# EasyEDA schematic SCH_Main_board_2023-06-05.json
TITLE: Sheet_1; REV: 1.0; Date: 2023-03-05; Sheet: 1/1; Drawn By: 张良桢; Company: 华北理工大学
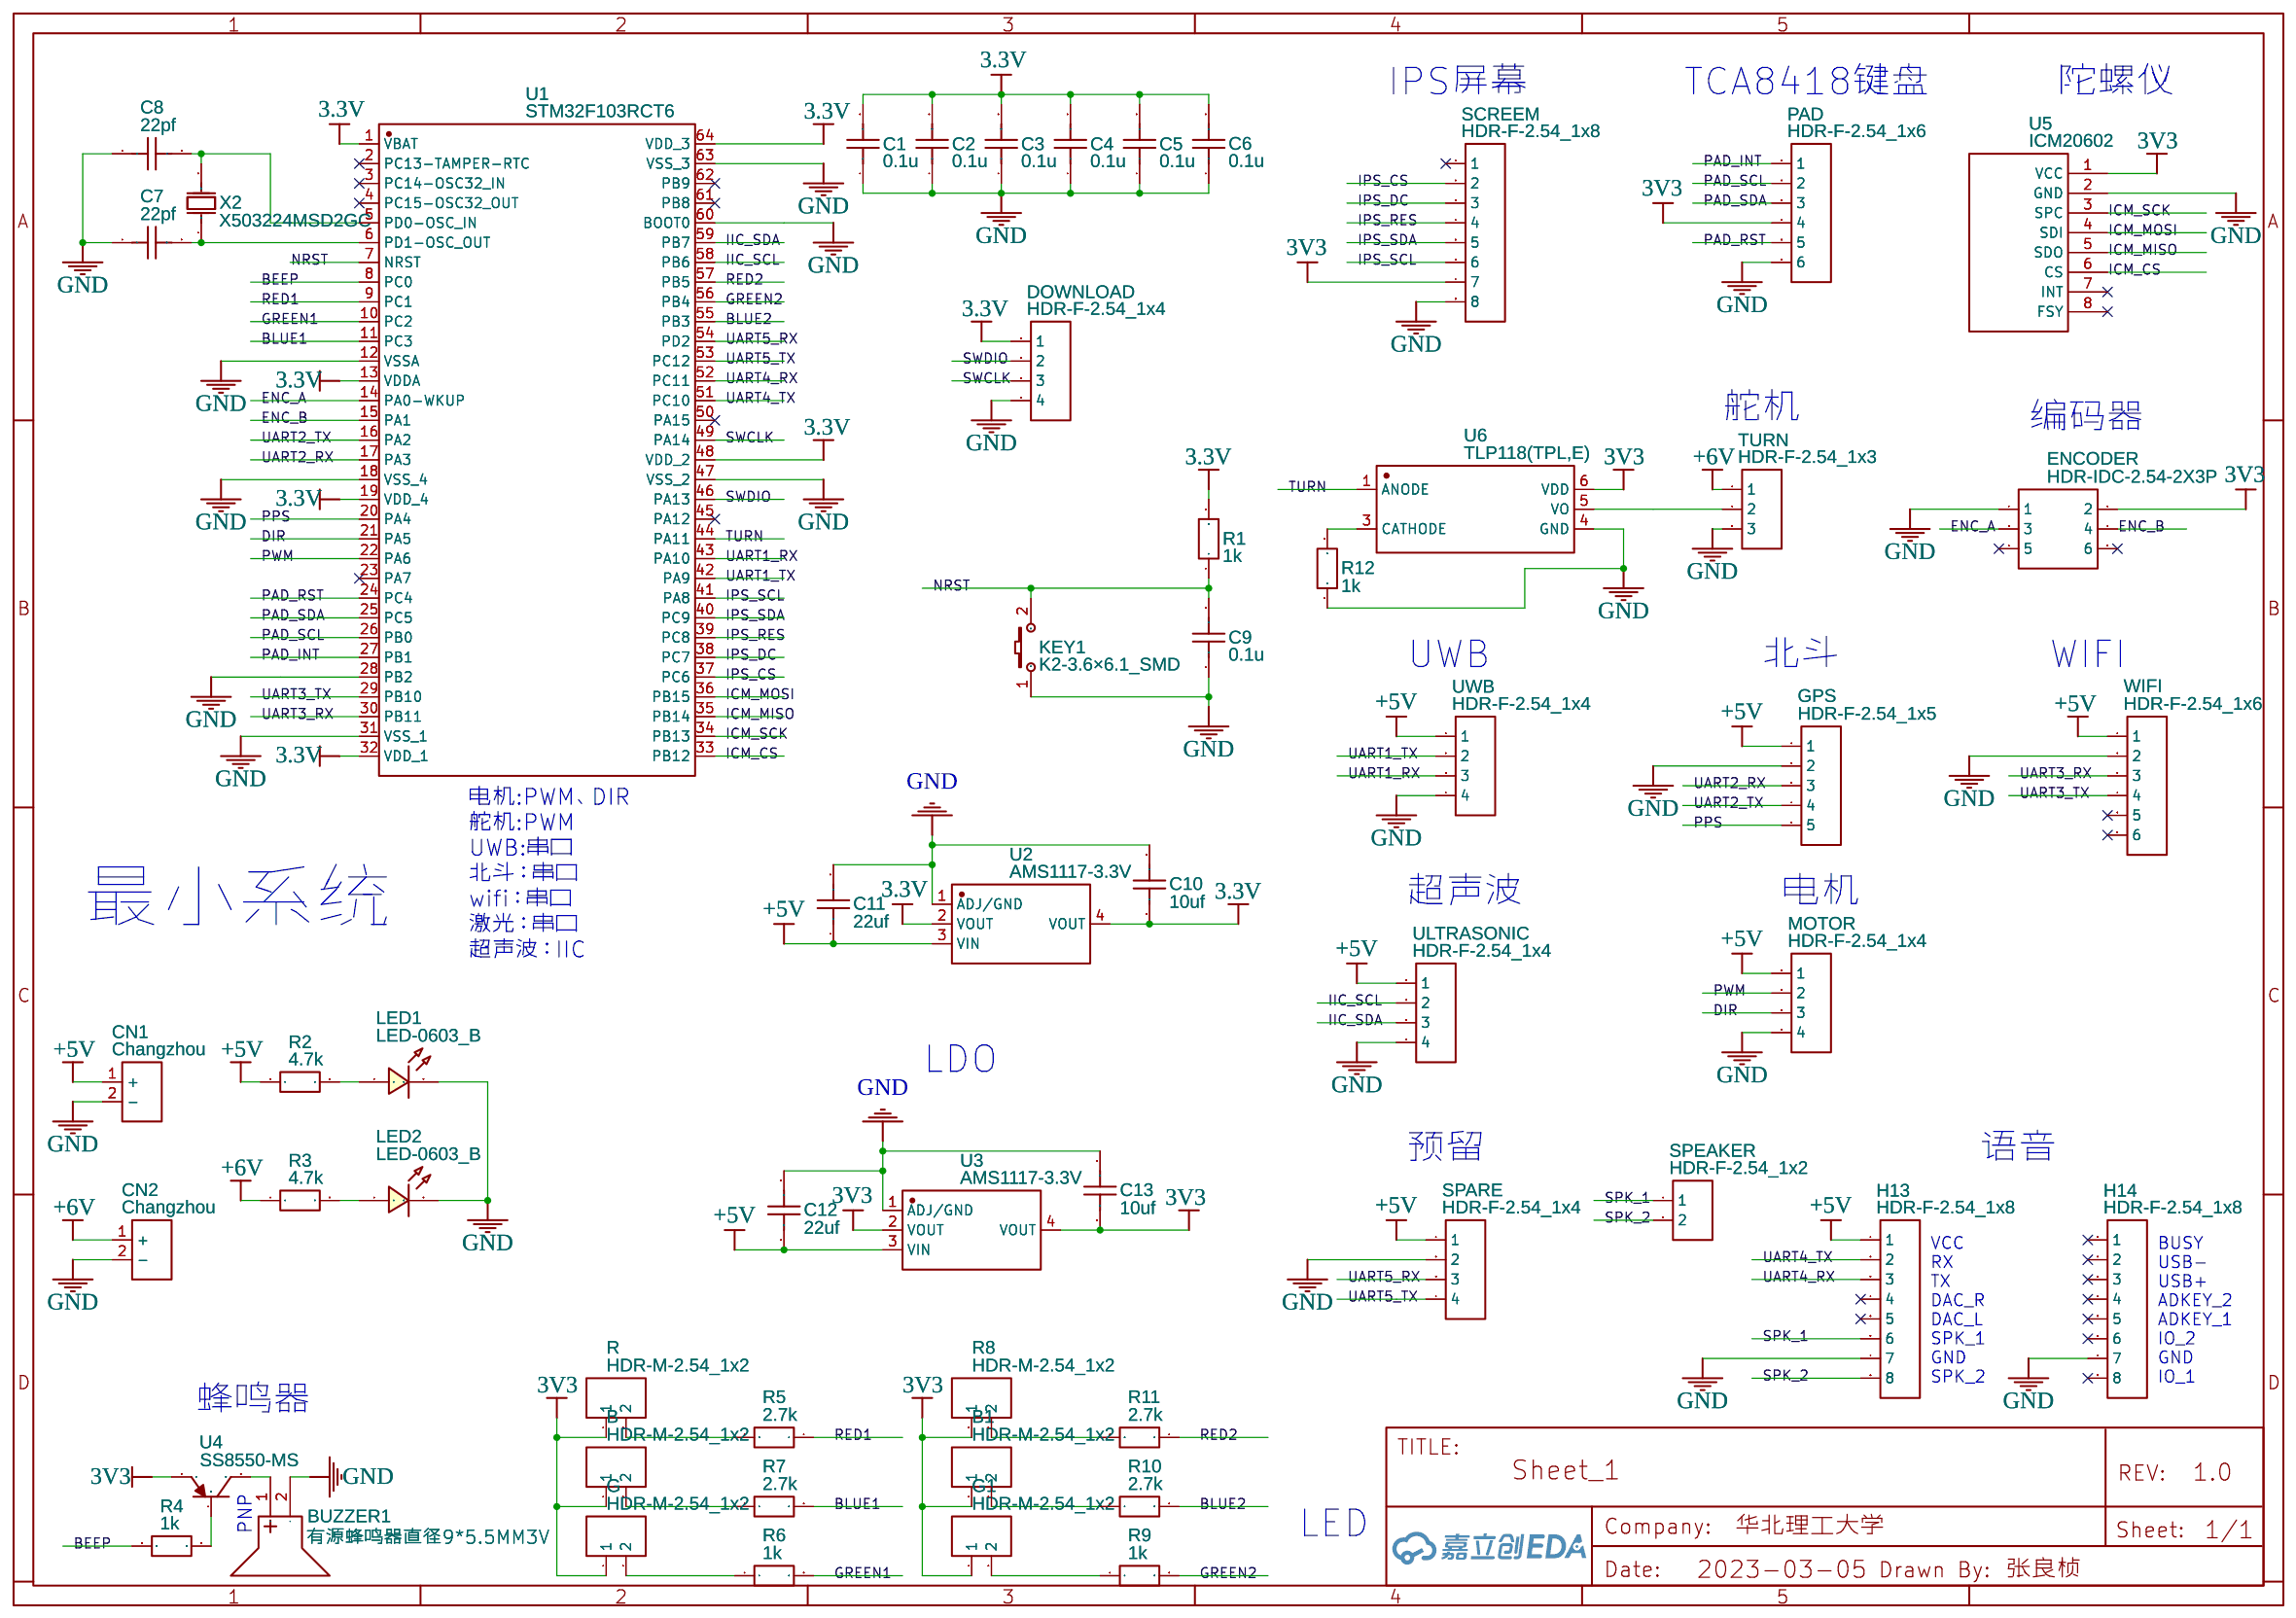
[diagram p0: schematic sheet]

## Parts
B  HDR-M-2.54_1x2  [HDR-M-2.54_1X2]
B1  HDR-M-2.54_1x2  [HDR-M-2.54_1X2]
BUZZER1  有源蜂鸣器直径9*5.5MM3V  [BUZ-TH_BD9.0-P5.00-D0.6-L-FD]
C1  0.1u  [C0603]
C2  0.1u  [C0603]
C3  0.1u  [C0603]
C4  0.1u  [C0603]
C5  0.1u  [C0603]
C6  0.1u  [C0603]
C7  22pf  [C0603]
C8  22pf  [C0603]
C9  0.1u  [C0603]
C10  10uf  [C0805]
C11  22uf  [C0805]
C12  22uf  [C0805]
C13  10uf  [C0805]
CN1  Changzhou  [CONN-TH_XT30UPB-F]
CN2  Changzhou  [CONN-TH_XT30UPB-F]
DOWNLOAD  HDR-F-2.54_1x4  [HDR-F-2.54_1X4]
ENCODER  HDR-IDC-2.54-2X3P  [IDC-TH_6P-P2.54_C11214]
G  HDR-M-2.54_1x2  [HDR-M-2.54_1X2]
G1  HDR-M-2.54_1x2  [HDR-M-2.54_1X2]
GPS  HDR-F-2.54_1x5  [HDR-F-2.54_1X5]
H13  HDR-F-2.54_1x8  [HDR-F-2.54_1X8]
H14  HDR-F-2.54_1x8  [HDR-F-2.54_1X8]
KEY1  K2-3.6×6.1_SMD  [KEY-SMD_2P-L6.2-W3.6-LS8.0]
LED1  LED-0603_B  [LED0603_BLUE]
LED2  LED-0603_B  [LED0603_BLUE]
MOTOR  HDR-F-2.54_1x4  [XHB2.54-4P]
PAD  HDR-F-2.54_1x6  [HDR-F-2.54_1X6]
R  HDR-M-2.54_1x2  [HDR-M-2.54_1X2]
R1  1k  [R0603]
R2  4.7k  [R0603]
R3  4.7k  [R0603]
R4  1k  [R0603]
R5  2.7k  [R0603]
R6  1k  [R0603]
R7  2.7k  [R0603]
R8  HDR-M-2.54_1x2  [HDR-M-2.54_1X2]
R9  1k  [R0603]
R10  2.7k  [R0603]
R11  2.7k  [R0603]
R12  1k  [R0603]
SCREEM  HDR-F-2.54_1x8  [HDR-F-2.54_1X8]
SPARE  HDR-F-2.54_1x4  [HDR-F-2.54_1X4]
SPEAKER  HDR-F-2.54_1x2  [HDR-F-2.54_1X2]
TURN  HDR-F-2.54_1x3  [HDR-F-2.54_1X3]
U1  STM32F103RCT6  [LQFP-64_L10.0-W10.0-P0.50-LS12.0-BL]
U2  AMS1117-3.3V  [SOT-223-4_L6.5-W3.5-P2.30-LS7.0-BR]
U3  AMS1117-3.3V  [SOT-223-4_L6.5-W3.5-P2.30-LS7.0-BR]
U4  SS8550-MS  [SOT-23-3_L2.9-W1.7-P1.90-LS2.8-BR]
U5  ICM20602  [ICM20602]
U6  TLP118(TPL,E)  [OPTO-SMD-5_L3.7-W4.6-P1.27-LS7.0-BR]
ULTRASONIC  HDR-F-2.54_1x4  [HDR-F-2.54_1X4]
UWB  HDR-F-2.54_1x4  [XHB2.54-4P]
WIFI  HDR-F-2.54_1x6  [HDR-F-2.54_1X6]
X2  X503224MSD2GC  [CRYSTAL-SMD_L5.0-W3.2]

## Library data of the parts
B B1 G G1 R R8 = HDR-M-2.54_1x2: Supplier Part: C124375; Supplier: LCSC; Contributor: LCEDA_Lib
BUZZER1 = 有源蜂鸣器直径9*5.5MM3V: Supplier: LCSC; Supplier Part: C9900012728; Manufacturer: null; Manufacturer Part: 有源蜂鸣器直径9*5.5mm3V; Contributor: LCSC; JLCPCB Part Class: Extended Part
C1-C9 = C_0603_US: Contributor: LCEDA_Lib
C10-C13 = C_0805_US: Contributor: LCEDA_Lib
CN1 CN2 = XT30UPB-F: Supplier: LCSC; Supplier Part: C108769; Manufacturer: AMASS(艾迈斯); Manufacturer Part: XT30UPB30-F.G.*; Contributor: LCSC; JLCPCB Part Class: Extended Part
DOWNLOAD MOTOR SPARE ULTRASONIC UWB = HDR-F-2.54_1x4: Supplier Part: C225501; Supplier: LCSC; Contributor: LCEDA_Lib
ENCODER = HDR-IDC-2.54-2X3P: Supplier: LCSC; Manufacturer: BOOMELE; Manufacturer Part: 2X3 2.54mm IDC Box; image: //image.lceda.cn/szlcsc/C11214.jpg; Supplier Part: C11214
GPS = HDR-F-2.54_1x5: Supplier Part: C50950; Supplier: LCSC; Contributor: LCEDA_Lib
H13 H14 SCREEM = HDR-F-2.54_1x8: Supplier Part: C225505; Supplier: LCSC; Contributor: LCEDA_Lib
KEY1 = K2-3.6×6.1_SMD: Supplier Part: C118141; Supplier: LCSC; Manufacturer Part: K2-1107ST-A4SW-06; Contributor: LCEDA_Lib; 制造商: 韩国韩荣
LED1 LED2 = LED-0603_B: Manufacturer: EVERLIGHT(台湾亿光); Manufacturer Part: 19-217/BHC-ZL1M2RY/3T; Supplier Part: C72041; Supplier: LCSC; Contributor: LCEDA_01
PAD WIFI = HDR-F-2.54_1x6: Supplier Part: C40877; Supplier: LCSC; Contributor: LCEDA_Lib
R1-R7 R9-R12 = R_0603_EU: Contributor: LCEDA_Lib
SPEAKER = HDR-F-2.54_1x2: Supplier Part: C49661; Supplier: LCSC; Contributor: LCEDA_Lib
TURN = HDR-F-2.54_1x3: Supplier Part: C146690; Supplier: LCSC; Contributor: LCEDA_Lib
U1 = STM32F103RCT6: Supplier: LCSC; Manufacturer: ST(意法半导体); Supplier Part: C8323; JLCPCB Part Class: Extended Part
U2 U3 = AMS1117-3.3V: Supplier: LCSC; Supplier Part: C2688239; Manufacturer: WPMtek(维攀微); Contributor: LCSC; JLCPCB Part Class: Extended Part
U4 = SS8550-MS: Supplier: LCSC; Supplier Part: C5120747; Manufacturer: MSKSEMI(美森科); link: https://atta.szlcsc.comnull; Contributor: lcsc
U5 = ICM20602: Contributor: zoeydyx
U6 = TLP118(TPL,E): Supplier: LCSC; Manufacturer: TOSHIBA(东芝); Supplier Part: C89721; JLCPCB Part Class: Extended Part
X2 = X503224MSD2GC: Supplier Part: C48304; Supplier: LCSC; Manufacturer: null; JLCPCB Part Class: Extended Part

## Nets
3.3V: C1.2 C2.2 C3.2 C4.2 C5.2 C6.2 C10.2 DOWNLOAD.1 R1.2 U1.1(VBAT) U1.13(VDDA) U1.19(VDD_4) U1.32(VDD_1) U1.48(VDD_2) U1.64(VDD_3) U2.2(VOUT) U2.4(VOUT)
3V3: B.1 B1.1 C13.2 ENCODER.2 G.1 G1.1 PAD.4 R.1 R8.1 SCREEM.7 U3.2(VOUT) U3.4(VOUT) U4.2(E) U5.1(VCC) U6.6(VDD)
+5V: C11.1 C12.1 CN1.1(+) GPS.1 H13.1 MOTOR.1 R2.1 SPARE.1 U2.3(VIN) U3.3(VIN) ULTRASONIC.1 UWB.1 WIFI.1
+6V: CN2.1(+) R3.1 TURN.1
GND: BUZZER1.2(-) C1.1 C2.1 C3.1 C4.1 C5.1 C6.1 C7.1 C8.1 C9.1 C10.1 C11.2 C12.2 C13.1 CN1.2(-) CN2.2(-) DOWNLOAD.4 ENCODER.1 GPS.2 H13.7 H14.7 KEY1.1 LED1.2 LED2.2 MOTOR.4 PAD.6 R12.1 SCREEM.8 SPARE.2 TURN.3 U1.12(VSSA) U1.18(VSS_4) U1.28(PB2) U1.31(VSS_1) U1.47(VSS_2) U1.60(BOOT0) U1.63(VSS_3) U2.1(ADJ/GND) U3.1(ADJ/GND) U5.2(GND) U6.4(GND) ULTRASONIC.4 UWB.4 WIFI.2
BEEP: R4.1 U1.8(PC0)
BLUE1: R7.2 U1.11(PC3)
BLUE2: R10.2 U1.55(PB3)
DIR: MOTOR.3 U1.21(PA5)
ENC_A: ENCODER.3 U1.14(PA0-WKUP)
ENC_B: ENCODER.4 U1.15(PA1)
GREEN1: R6.2 U1.10(PC2)
GREEN2: R9.2 U1.56(PB4)
ICM_CS: U1.33(PB12) U5.6(CS)
ICM_MISO: U1.35(PB14) U5.5(SDO)
ICM_MOSI: U1.36(PB15) U5.4(SDI)
ICM_SCK: U1.34(PB13) U5.3(SPC)
IIC_SCL: U1.58(PB6) ULTRASONIC.2
IIC_SDA: U1.59(PB7) ULTRASONIC.3
IPS_CS: SCREEM.2 U1.37(PC6)
IPS_DC: SCREEM.3 U1.38(PC7)
IPS_RES: SCREEM.4 U1.39(PC8)
IPS_SCL: SCREEM.6 U1.41(PA8)
IPS_SDA: SCREEM.5 U1.40(PC9)
NRST: C9.2 KEY1.2 R1.1 U1.7(NRST)
PAD_INT: PAD.1 U1.27(PB1)
PAD_RST: PAD.5 U1.24(PC4)
PAD_SCL: PAD.2 U1.26(PB0)
PAD_SDA: PAD.3 U1.25(PC5)
PPS: GPS.5 U1.20(PA4)
PWM: MOTOR.2 U1.22(PA6)
RED1: R5.1 U1.9(PC1)
RED2: R11.1 U1.57(PB5)
SPK_1: H13.6 SPEAKER.1
SPK_2: H13.8 SPEAKER.2
SWCLK: DOWNLOAD.3 U1.49(PA14)
SWDIO: DOWNLOAD.2 U1.46(PA13)
TURN: U1.44(PA11) U6.1(ANODE)
UART1_RX: U1.43(PA10) UWB.3
UART1_TX: U1.42(PA9) UWB.2
UART2_RX: GPS.3 U1.17(PA3)
UART2_TX: GPS.4 U1.16(PA2)
UART3_RX: U1.30(PB11) WIFI.3
UART3_TX: U1.29(PB10) WIFI.4
UART4_RX: H13.3 U1.52(PC11)
UART4_TX: H13.2 U1.51(PC10)
UART5_RX: SPARE.3 U1.54(PD2)
UART5_TX: SPARE.4 U1.53(PC12)
Net-(B1-2): B1.2 R10.1
Net-(B-2): B.2 R7.1
Net-(BUZZER1-1): BUZZER1.1(+) U4.3(C)
Net-(C7-2): C7.2 U1.6(PD1-OSC_OUT) X2.1(OSC1)
Net-(C8-2): C8.2 U1.5(PD0-OSC_IN) X2.2(OSC2)
Net-(G1-2): G1.2 R9.1
Net-(G-2): G.2 R6.1
Net-(LED1-1): LED1.1 R2.2
Net-(LED2-1): LED2.1 R3.2
Net-(R4-2): R4.2 U4.1(B)
Net-(R8-2): R8.2 R11.2
Net-(R12-2): R12.2 U6.3(CATHODE)
Net-(R-2): R.2 R5.2
Net-(TURN-2): TURN.2 U6.5(VO)

Not connected (* = marked no-connect by the designer): ENCODER 5* 6*; H13 4* 5*; H14 1* 2* 3* 4* 5* 6* 8*; SCREEM 1*; U1 2(PC13-TAMPER-RTC)* 3(PC14-OSC32_IN)* 4(PC15-OSC32_OUT)* 23(PA7)* 45(PA12)* 50(PA15)* 61(PB8)* 62(PB9)*; U5 7(INT)* 8(FSY)*; WIFI 5* 6*

## Notes on the sheet
- IPS屏幕
- TCA8418键盘
- 陀螺仪
- 舵机
- 编码器
- UWB
- 北斗
- WIFI
- 电机:PWM、DIR
  舵机:PWM
  UWB:串口
  北斗：串口
  wifi：串口
  激光：串口
  超声波：IIC
- 最小系统
- 超声波
- 电机
- LDO
- 预留
- 语音
- VCC
  RX
  TX
  DAC_R
  DAC_L
  SPK_1
  GND
  SPK_2
- BUSY
  USB-
  USB+
  ADKEY_2
  ADKEY_1
  IO_2
  GND
  IO_1
- 蜂鸣器
- LED
- PNP
